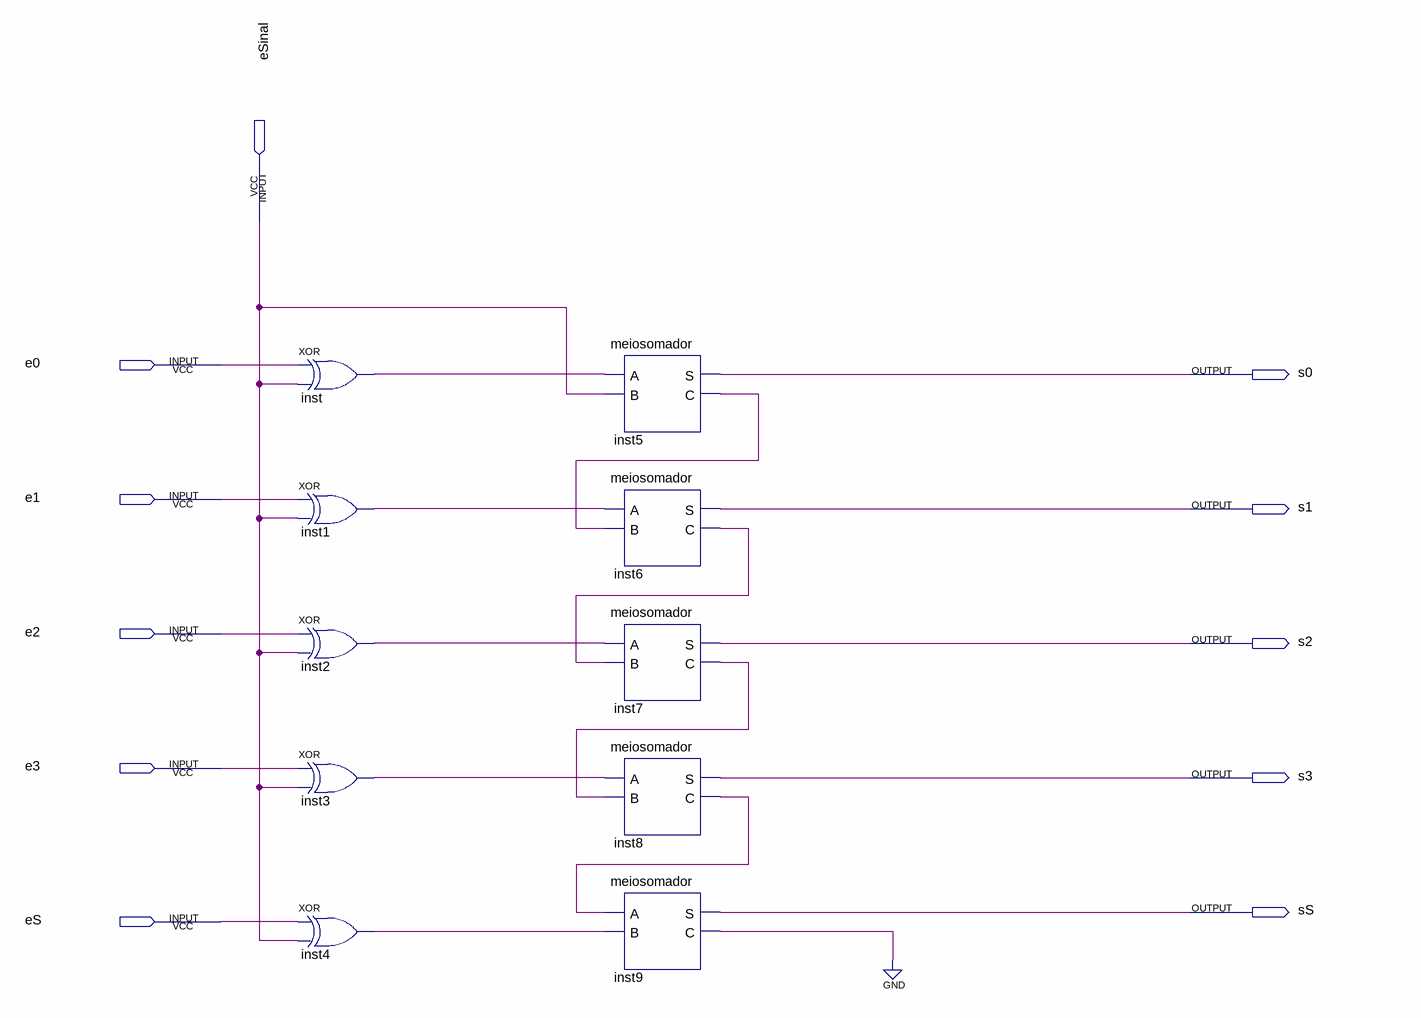
[diagram p0: schematic sheet]
// Quartus schematic comp2.bdf as structural Verilog: 10 symbols, 11 pins
module comp2 (
  input  eSinal,
  input  e0,
  input  e1,
  input  e2,
  input  e3,
  input  eS,
  output s0,
  output s1,
  output s2,
  output s3,
  output sS
);

  wire inst1_out, inst2_out, inst3_out, inst4_out, inst5_c, inst6_c, inst7_c, inst8_c, inst9_c, inst_out;

  xor inst (inst_out, e0, eSinal);
  xor inst1 (inst1_out, e1, eSinal);
  xor inst2 (inst2_out, e2, eSinal);
  xor inst3 (inst3_out, e3, eSinal);
  xor inst4 (inst4_out, eS, eSinal);
  meiosomador inst5 (.A(inst_out), .B(eSinal), .S(s0), .C(inst5_c));
  meiosomador inst6 (.A(inst1_out), .B(inst5_c), .S(s1), .C(inst6_c));
  meiosomador inst7 (.A(inst2_out), .B(inst6_c), .S(s2), .C(inst7_c));
  meiosomador inst8 (.A(inst3_out), .B(inst7_c), .S(s3), .C(inst8_c));
  meiosomador inst9 (.A(inst8_c), .B(inst4_out), .S(sS), .C(inst9_c));
  // also tied to GND on the sheet: inst9_c
endmodule
